# Altium schematic sheet EE209_Schematic.SchDoc: Wireless Energy Monitor
size A3; Author: Team XX; Organization: EE/CS 209 Class of 2022; Address1: Department of ECSE; Address2: The University of Auckland; Address3: 20 Symonds Street; Address4: Auckland, NZ; Revision: 1.0; SheetNumber: 1; SheetTotal: 1
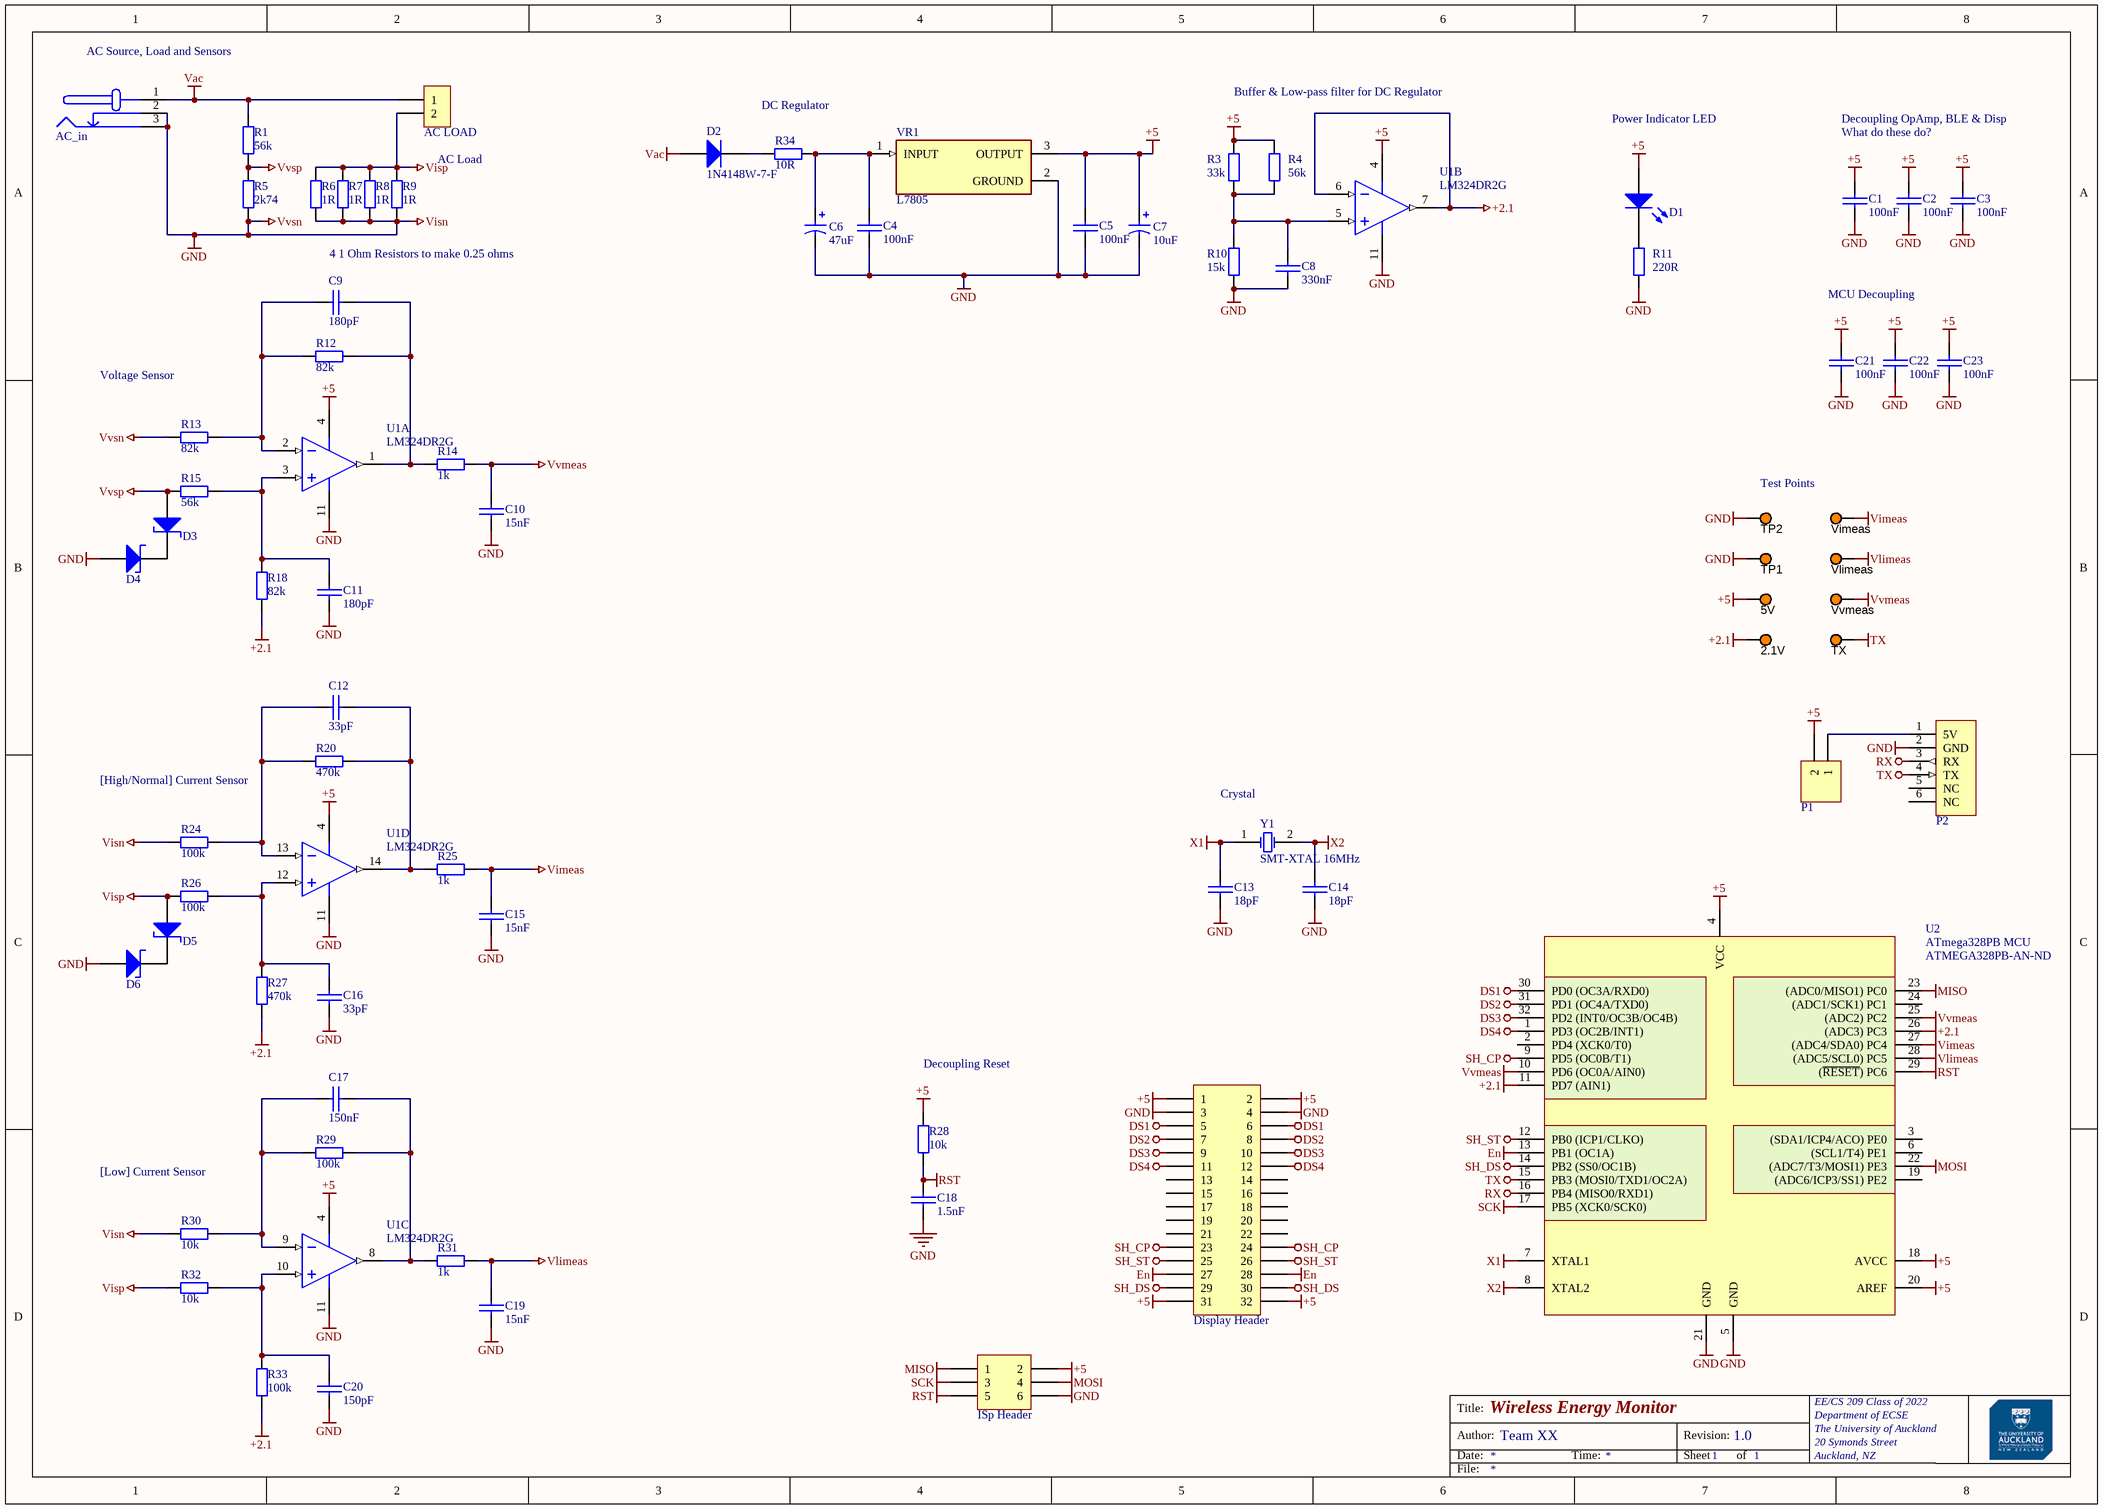
[diagram p0: EE209_Schematic.SchDoc]

## Parts
2.1V  5003  [TP_TH]  (value not drawn)
5V  5003  [TP_TH]  (value not drawn)
AC_in  DC barrel jack  [AC-Socket]  (value not drawn)
AC_LOAD  AC Load  [Dual Banana Plug]
C1  100nF  [0805 CAP]
C2  100nF  [0805 CAP]
C3  100nF  [0805 CAP]
C4  100nF  [0805 CAP]
C5  100nF  [0805 CAP]
C6  47uF  [CAP POL 8x5.4mm SMT]
C7  10uF  [CAP POL 8x5.4mm SMT]
C8  330nF  [0805 CAP]
C9  180pF  [0805 CAP]
C10  15nF  [0805 CAP]
C11  180pF  [0805 CAP]
C12  33pF  [0805 CAP]
C13  18pF  [0805 CAP]
C14  18pF  [0805 CAP]
C15  15nF  [0805 CAP]
C16  33pF  [0805 CAP]
C17  150nF  [0805 CAP]
C18  1.5nF  [0805 CAP]
C19  15nF  [0805 CAP]
C20  150pF  [0805 CAP]
C21  100nF  [0805 CAP]
C22  100nF  [0805 CAP]
C23  100nF  [0805 CAP]
D1  LTST-C170KGKT  [0805 LED]  (value not drawn)
D2  1N4148W-7-F  [SOD123]
D3  BZT52H-B4V7  [SOD123]  (value not drawn)
D4  BZT52H-B4V7  [SOD123]  (value not drawn)
D5  BZT52H-B4V7  [SOD123]  (value not drawn)
D6  BZT52H-B4V7  [SOD123]  (value not drawn)
Display_Header  Display  [Display]  (value not drawn)
ISp_Header  Header 3X2  [ECE-BHDR2X3]  (value not drawn)
P1  Header 2  [ece-HDR1X2]  (value not drawn)
P2  BLE Module Header  [HM10_HDR1X6]  (value not drawn)
R1  56k  [0805 RES]
R3  33k  [0805 RES]
R4  56k  [0805 RES]
R5  2k74  [0805 RES]
R6  1R  [0805 RES]
R7  1R  [0805 RES]
R8  1R  [0805 RES]
R9  1R  [0805 RES]
R10  15k  [0805 RES]
R11  220R  [0805 RES]
R12  82k  [0805 RES]
R13  82k  [0805 RES]
R14  1k  [0805 RES]
R15  56k  [0805 RES]
R18  82k  [0805 RES]
R20  470k  [0805 RES]
R24  100k  [0805 RES]
R25  1k  [0805 RES]
R26  100k  [0805 RES]
R27  470k  [0805 RES]
R28  10k  [0805 RES]
R29  100k  [0805 RES]
R30  10k  [0805 RES]
R31  1k  [0805 RES]
R32  10k  [0805 RES]
R33  100k  [0805 RES]
R34  10R  [AXIAL-0.4]
TP1  5003  [TP_TH]  (value not drawn)
TP2  5003  [TP_TH]  (value not drawn)
TX  5003  [TP_TH]  (value not drawn)
U1  LM324DR2G  [SOIC-14]  (parts A,B,C,D of 4)
U2  ATmega328PB MCU  Supplier Part Number 1: ATMEGA328PB-AN-ND  [32 - TQFP]
Vimeas  5003  [TP_TH]  (value not drawn)
Vlimeas  5003  [TP_TH]  (value not drawn)
VR1  L7805  [TO255P1020X450X2000-3]
Vvmeas  5003  [TP_TH]  (value not drawn)
Y1  SMT-XTAL 16MHz  [HC49-US]

## Nets
+2.1: 2.1V.1 R18.2 R27.2 R33.2 U1.6(IN2-) U1.7(OUT2) U2.11(PD7_(AIN1)) U2.26((ADC3)_PC3)
+5: 5V.1 C1.1 C2.1 C3.1 C5.1 C7.1 C21.1 C22.1 C23.1 D1.1(A) Display_Header.1 Display_Header.2 Display_Header.31 Display_Header.32 ISp_Header.2 P1.2 R3.2 R4.2 R28.2 U1.4(VCC) U2.4(VCC) U2.18(AVCC) U2.20(AREF) VR1.3(OUTPUT)
DS1: Display_Header.5 Display_Header.6 U2.30(PD0_(OC3A/RXD0))
DS2: Display_Header.7 Display_Header.8 U2.31(PD1_(OC4A/TXD0))
DS3: Display_Header.9 Display_Header.10 U2.32(PD2_(INT0/OC3B/OC4B))
DS4: Display_Header.11 Display_Header.12 U2.1(PD3_(OC2B/INT1))
En: Display_Header.27 Display_Header.28 U2.13(PB1_(OC1A))
GND: AC_in.2(GND_ALT) AC_in.3(GND) C1.2 C2.2 C3.2 C4.2 C5.2 C6.2 C7.2 C8.2 C10.1 C11.2 C13.2 C14.2 C15.1 C16.2 C18.2 C19.1 C20.2 C21.2 C22.2 C23.2 D4.1(A) D6.1(A) Display_Header.3 Display_Header.4 ISp_Header.6 P2.2(GND) R5.1 R6.1 R7.1 R8.1 R9.1 R10.1 R11.1 R13.1 R24.1 R30.1 TP1.1 TP2.1 U1.11(VEE/GND) U2.5(GND) U2.21(GND) VR1.2(GROUND)  [also labelled Visn, Vvsn]
MISO: ISp_Header.1 U2.23((ADC0/MISO1)_PC0)
MOSI: ISp_Header.4 U2.22((ADC7/T3/MOSI1)_PE3)
RST: C18.1 ISp_Header.5 R28.1 U2.29((~{RESET})_PC6)
RX: P2.3(RX) U2.16(PB4_(MISO0/RXD1))
SCK: ISp_Header.3 U2.17(PB5_(XCK0/SCK0))
SH_CP: Display_Header.23 Display_Header.24 U2.9(PD5_(OC0B/T1))
SH_DS: Display_Header.29 Display_Header.30 U2.14(PB2_(SS0/OC1B))
SH_ST: Display_Header.25 Display_Header.26 U2.12(PB0_(ICP1/CLKO))
TX: P2.4(TX) TX.1 U2.15(PB3_(MOSI0/TXD1/OC2A))
Vac: AC_in.1(VCC) AC_LOAD.1 D2.1(A) R1.2
Vimeas: C15.2 R25.1 U2.27((ADC4/SDA0)_PC4) Vimeas.1
Visp: AC_LOAD.2 D5.1(A) R6.2 R7.2 R8.2 R9.2 R26.1 R32.1
Vlimeas: C19.2 R31.1 U2.28((ADC5/SCL0)_PC5) Vlimeas.1
Vvmeas: C10.2 R14.1 U2.10(PD6_(OC0A/AIN0)) U2.25((ADC2)_PC2) Vvmeas.1
Vvsp: D3.1(A) R1.1 R5.2 R15.1
X1: C13.1 U2.7(XTAL1) Y1.1(OSC1)
X2: C14.1 U2.8(XTAL2) Y1.2(OSC2)
NetC4_1: C4.1 C6.1 R34.2 VR1.1(INPUT)
NetC8_1: C8.1 R3.1 R4.1 R10.2 U1.5(IN2+)
NetC9_1: C9.1 R12.2 R13.2 U1.2(IN1-)
NetC9_2: C9.2 R12.1 R14.2 U1.1(OUT1)
NetC11_1: C11.1 R15.2 R18.1 U1.3(IN1+)
NetC12_1: C12.1 R20.2 R24.2 U1.13(IN4-)
NetC12_2: C12.2 R20.1 R25.2 U1.14(OUT4)
NetC16_1: C16.1 R26.2 R27.1 U1.12(IN4+)
NetC17_1: C17.1 R29.2 R30.2 U1.9(IN3-)
NetC17_2: C17.2 R29.1 R31.2 U1.8(OUT3)
NetC20_1: C20.1 R32.2 R33.1 U1.10(IN3+)
NetD1_2: D1.2(K) R11.2
NetD2_2: D2.2(K) R34.1
NetD3_2: D3.2(K) D4.2(K)
NetD5_2: D5.2(K) D6.2(K)
NetP1_1: P1.1 P2.1(5V)

Not connected (* = marked no-connect by the designer): Display_Header 13 14 15 16 17 18 19 20 21 22; P2 5(NC) 6(NC); U2 2(PD4_(XCK0/T0)) 3((SDA1/ICP4/ACO)_PE0) 6((SCL1/T4)_PE1) 19((ADC6/ICP3/SS1)_PE2) 24((ADC1/SCK1)_PC1)

## Notes on the sheet
- (near AC_in) AC Source, Load and Sensors
- DC Regulator
- Buffer & Low-pass filter for DC Regulator
- Power Indicator LED
- Decoupling OpAmp, BLE & Disp
- What do these do?
- 4 1 Ohm Resistors to make 0.25 ohms
- MCU Decoupling
- Voltage Sensor
- Test Points
- [High/Normal] Current Sensor
- (near Y1) Crystal
- Decoupling Reset
- [Low] Current Sensor
- Title:
- Author:
- Date:
- Time:
- Revision:
- Sheet
- of
- File:

## Library data of the parts
2.1V 5V TP1 TP2 TX Vimeas Vlimeas Vvmeas = TestPoint: Test Point, Orange, 1-Pin THD, RoHS; Peak Reverse Current: 600 uA; Forward Current: 3 A; Max Surge Current: 80 A; Forward Voltage: 1.08 V; Max Operating Temperature: 150 degC; PackageReference: 5003; Pins: 2; ComponentLink2URL: http://keyelco.com/userAssets/file/M65p56.pdf; PackageDescription: 1-Pin Through Hole Device, Dia 2.54 mm; Weight: 0.01 lb; Diameter: 5.3 mm; Mount: Through Hole; Package Quantity: 500; Packaging: Bulk; Min Operating Temperature: -65 degC; ComponentLink1Description: Manufacturer URL; Height: 0.25 inch; ComponentLink1URL: http://www.keyelco.com/; ComponentLink2Description: Datasheet; Width: 0.25 inch; REACH SVHC: No SVHC; RoHSCompliant: true; Radiation Hardening: No; Length: 9.5 mm; DatasheetVersion: Jun-15
AC_in = AC_Input: DC barrel jack connection to AC source; Value: socket
AC_LOAD = AC_Output: Dual banana plugs connection to the AC load; LatestRevisionDate: 17-Jul-2002; LatestRevisionNote: Re-released for DXP Platform.; Publisher: Altium Limited
C1-C5 C8-C23 = CerCap_SMT_0805: SMT ceramic capacitor 0805 size; Value: *
C6 C7 = ElecCap_SMT_8D0: CAP ALUM 22UF 20% 50V SMD (Model: UWX1H220MCL1GB); Manufacturer: Nichicon; Manufacturer Part Number: UWX1V220MCL1GB; Lifetime @ Temp.: 2000 Hrs @ 85°C; Polarization: Polar; Surface Mount Land Size: 0.260" L x 0.260" W (6.60mm x 6.60mm); Capacitance 1: 22 µF; Revision: July-2002: Re-released for DXP Platform.; RoHS: RoHS Compliant; Category: Capacitors; Stock 1: 680; Pricing 1: 1=0.59, 10=0.406, 100=0.2304, 500=0.16268 (NZD); Packaging: Cut Tape (CT); Part Status: Active; Tolerance: ±20%; ESR (Equivalent Series Resistance): -; Operating Temperature: -40°C ~ 85°C; Ratings: -; Applications: General Purpose; Lead Spacing: -; Size / Dimension: 0.248" Dia (6.30mm); Height - Seated (Max): 0.213" (5.40mm); Mounting Type: Surface Mount; Package / Case: Radial, Can - SMD; ComponentLink1URL: http://nichicon-us.com/english/products/pdfs/e-uwx.pdf; ComponentLink1Description: http://nichicon-us.com/english/products/pdfs/e-uwx.pdf; Supplier 1: Digi-Key; Supplier Part Number 1: 493-2136-1-ND; Value: *
D1 = LED_SMT_0805: SMT LED 0805 size; Manufacturer: Lite-On Inc.; Color: Green; Lens Color: Colorless; Lens Transparency: Clear; Millicandela Rating: 35mcd; Lens Style/Size: Rectangle with Flat Top, 1.40mm x 1.25mm; Voltage - Forward (Vf) (Typ): 2V; Current - Test: 20mA; Viewing Angle: 130°; Wavelength - Dominant: 571nm; Wavelength - Peak: 574nm; Supplier 1: Digi-Key; Manufacturer Part Number: LTST-C170KGKT; RoHS: RoHS Compliant; Category: Optoelectronics; Stock 1: 503069; Pricing 1: 1=0.62, 10=0.459, 25=0.338, 100=0.2415, 250=0.16416, 500=0.14486, 1000=0.11347 (NZD); Packaging: Cut Tape (CT); Part Status: Active; Mounting Type: Surface Mount; Features: -; Package / Case: 0805 (2012 Metric); Size / Dimension: 2.00mm L x 1.25mm W; Height (Max): 1.10mm; ComponentLink1URL: http://optoelectronics.liteon.com/upload/download/DS22-2000-073/LTST-C170KGKT.pdf; ComponentLink1Description: http://optoelectronics.liteon.com/upload/download/DS22-2000-073/LTST-C170KGKT.pdf; Supplier Part Number 1: 160-1414-1-ND
D2 = 1N4148_SMT_SOD123: DIODE GEN PURP 100V 300MA SOD123; Manufacturer: Diodes Incorporated; Manufacturer Part Number: 1N4148W-13-F; Diode Type: Standard; Current - Average Rectified (Io): 150mA; Speed: Small Signal =< 200mA (Io), Any Speed; Capacitance @ Vr, F: 2pF @ 0V, 1MHz; Supplier 1: Digi-Key; RoHS: RoHS Compliant; Category: Discrete Semiconductor Products; Stock 1: 5282; Pricing 1: 1=0.33, 10=0.292, 100=0.1586, 500=0.0976, 1000=0.06656 (NZD); Packaging: Cut Tape (CT); Part Status: Active; Mounting Type: Surface Mount; Package / Case: SOD-123; Supplier Device Package: SOD-123; Operating Temperature - Junction: -65°C ~ 150°C; Base Part Number: 1N4148W; ComponentLink1URL: https://www.diodes.com/assets/Datasheets/ds30086.pdf; ComponentLink1Description: https://www.diodes.com/assets/Datasheets/ds30086.pdf; Supplier Part Number 1: 1N4148W-13FDICT-ND
D3-D6 = Zener_SMT_SOD123: SMT zener diode with SOD123 package; Manufacturer: Nexperia USA Inc.; Manufacturer Part Number: BZT52H-B4V7,115; Tolerance: ±2%; Supplier 1: Digi-Key; RoHS: RoHS Compliant; Category: Discrete Semiconductor Products; Stock 1: 0; Pricing 1: 1=0.51, 10=0.408, 100=0.2164, 500=0.14232, 1000=0.09678 (NZD); Packaging: Cut Tape (CT); Part Status: Active; Operating Temperature: -65°C ~ 150°C (TA); Mounting Type: Surface Mount; Package / Case: SOD-123F; Supplier Device Package: SOD-123F; ComponentLink1URL: https://assets.nexperia.com/documents/data-sheet/BZT52H_SER.pdf; ComponentLink1Description: https://assets.nexperia.com/documents/data-sheet/BZT52H_SER.pdf; Supplier Part Number 1: 1727-1611-1-ND
Display_Header = Display: 16-Pin Header Connecting Display
P1 = Header 2: Header, 2-Pin; LatestRevisionDate: 17-Jul-2002; LatestRevisionNote: Re-released for DXP Platform.; Publisher: Altium Limited
P2 = BLEModule_TH: 2.54mm pitch 6-pin header for BLE module; LatestRevisionDate: 17-Jul-2002; LatestRevisionNote: Re-released for DXP Platform.; Publisher: Altium Limited
R1 R3-R15 R18 R20 R24-R33 = Res_SMT_0805: 0805 resistor; Published: 8-Jun-2000; LatestRevisionDate: 17-Jul-2002; LatestRevisionNote: Re-released for DXP Platform.; PackageReference: AXIAL-0.4; Publisher: Altium Limited; Value: *; ComponentLink1Description: https://nz.mouser.com/datasheet/2/315/AOA0000C304-1149620.pdf
R34 = Res_TH_0AX4: Through hole resistor; Published: 8-Jun-2000; LatestRevisionDate: 17-Jul-2002; LatestRevisionNote: Re-released for DXP Platform.; PackageReference: AXIAL-0.4; Publisher: Altium Limited; Value: *; ComponentLink1Description: http://www.royalohm.com/pdf/product2017/PrecisionMetalMF.pdf
U1 = LM324DR_SMT_SOIC16: Single Supply Quad Operational Amplifier, 3 to 32 V, 0 to 70 degC, 14-Pin SOIC, Pb-Free, Tape and Reel; Manufacturer: On Semiconductor; VCC Max (V): 32; VCC Min (V): 3; PackageVersion: Rev. K, 05/2011; ComponentLink3URL: http://www.onsemi.com/pub_link/Collateral/751A-03.PDF; ComponentLink3Description: Package Specification; Packing: Tape and Reel; ComponentLink2URL: http://www.onsemi.cn/pub_link/Collateral/LM324-D.PDF; PackageReference: SOIC-14-751A-03; ComponentLink1URL: http://www.onsemi.com/; PackageDescription: 14-Pin Small Outline Integrated Circuit, Body 8.65 x 3.9 mm, Pitch 1.27 mm; ComponentLink1Description: Manufacturer URL; DatasheetVersion: Rev. 25; Mounting Technology: Surface Mount; RoHS: TRUE; ComponentLink2Description: Datasheet; PartNumber: LM324DR2G
U2 = ATmega328PB_SMT_TQFP32: IC MCU 8BIT 32KB FLASH 32TQFP; Manufacturer: Atmel; Manufacturer Part Number: ATMEGA328PB-AN; Core Processor: AVR; Core Size: 8-Bit; Speed: 20MHz; Connectivity: I²C, SPI, UART/USART; Peripherals: Brown-out Detect/Reset, POR, PWM, WDT; Number of I/O: 27; Program Memory Size: 32KB (16K x 16); EEPROM Size: 1K x 8; RAM Size: 2K x 8; Voltage - Supply (Vcc/Vdd): 1.8 V ~ 5.5 V; Data Converters: A/D 8x10b; Oscillator Type: Internal; Supplier 1: Digi-Key; RoHS: RoHS Compliant; Category: Integrated Circuits (ICs); Stock 1: 366; Pricing 1: 1=2.74, 10=2.448, 25=2.2032, 100=2.0074, 250=1.81152, 500=1.62548, 1000=1.37088 (USD); Packaging: Tray; Part Status: Active; Program Memory Type: FLASH; Operating Temperature: -40°C ~ 105°C (TA); Package / Case: 32-TQFP; Supplier Device Package: 32-TQFP (7x7); ComponentLink1URL: http://www.atmel.com/images/atmel-42397-8-bit-avr-microcontroller-atmega328pb_datasheet.pdf; ComponentLink1Description: http://www.atmel.com/images/atmel-42397-8-bit-avr-microcontroller-atmega328pb_datasheet.pdf
VR1 = L7805: Standard Regulator Pos 5V 1.5A 3-Pin(3+Tab) TO-220FP Tube; MF: STMicroelectronics; MP: L7805; Value: *; SnapEDA_Link: https://www.snapeda.com/parts/L7805/STMicroelectronics/view-part/?ref=snap; Price: None; Package: None; Check_prices: https://www.snapeda.com/parts/L7805/STMicroelectronics/view-part/?ref=eda; Availability: Not in stock
Y1 = TXC9C-16_XTAL_SMT: 9C-16.000MAAJ-T crystal 16.0000MHZ 18PF SMD; Manufacturer: TXC CORPORATION; Frequency Stability: ±30ppm; Operating Mode: Fundamental; Supplier 1: Digi-Key; Manufacturer Part Number: 9C-16.000MAAJ-T; RoHS: RoHS Compliant; Category: Crystals, Oscillators, Resonators; Stock 1: 11514; Pricing 1: 1=0.75, 10=0.628, 50=0.5656, 100=0.5026, 500=0.47744 (NZD); Packaging: Cut Tape (CT); Part Status: Active; Type: MHz Crystal; Frequency Tolerance: ±30ppm; Load Capacitance: 18pF; Operating Temperature: -20°C ~ 70°C; Ratings: -; Mounting Type: Surface Mount; Package / Case: HC-49/US; Size / Dimension: 0.449" L x 0.189" W (11.40mm x 4.80mm); Height - Seated (Max): 0.161" (4.10mm); ComponentLink1URL: http://www.txccorp.com/download/products/quartz_crystals/2015TXC_9C_32.pdf; ComponentLink1Description: http://www.txccorp.com/download/products/quartz_crystals/2015TXC_9C_32.pdf; Supplier Part Number 1: 887-1059-1-ND